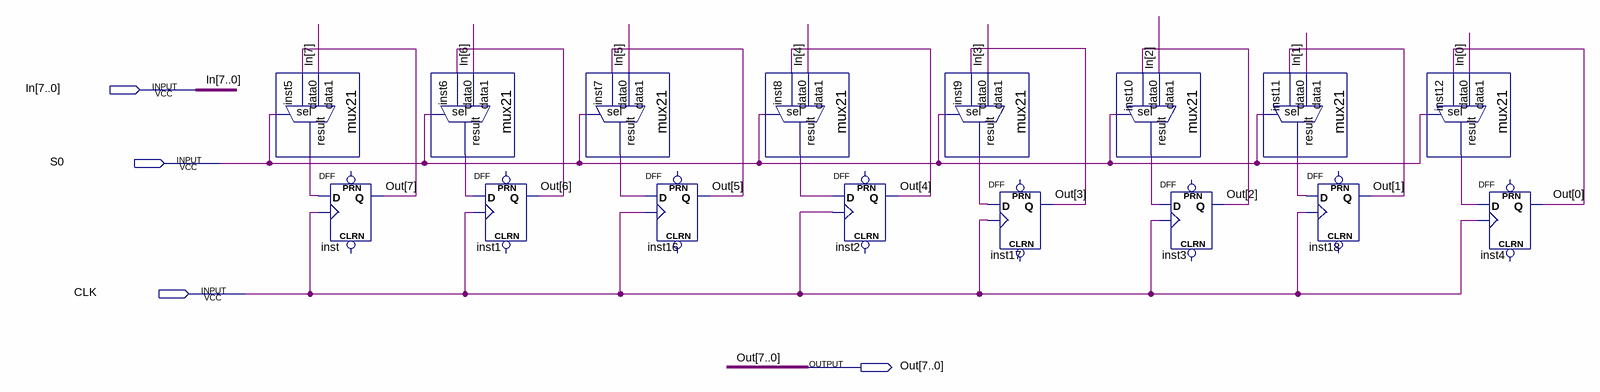
[diagram p0: schematic sheet]
// Quartus schematic Thanh_Ghi_8bit.bdf as structural Verilog: 16 symbols, 4 pins
module Thanh_Ghi_8bit (
  input  [7:0] In,
  input  S0,
  input  CLK,
  output [7:0] Out
);

  wire inst5_result, inst6_result, inst7_result, inst8_result, inst9_result, inst10_result, inst11_result,
       inst12_result;

  mux21 inst5 (.data1(In[7]), .data0(Out[7]), .sel(S0), .result(inst5_result));
  DFF inst (.CLK(CLK), .D(inst5_result), .Q(Out[7]));  // open: CLRN, PRN
  mux21 inst6 (.data1(In[6]), .data0(Out[6]), .sel(S0), .result(inst6_result));
  DFF inst1 (.CLK(CLK), .D(inst6_result), .Q(Out[6]));  // open: CLRN, PRN
  mux21 inst7 (.data1(In[5]), .data0(Out[5]), .sel(S0), .result(inst7_result));
  DFF inst16 (.CLK(CLK), .D(inst7_result), .Q(Out[5]));  // open: CLRN, PRN
  mux21 inst8 (.data1(In[4]), .data0(Out[4]), .sel(S0), .result(inst8_result));
  DFF inst2 (.CLK(CLK), .D(inst8_result), .Q(Out[4]));  // open: CLRN, PRN
  mux21 inst9 (.data1(In[3]), .data0(Out[3]), .sel(S0), .result(inst9_result));
  DFF inst17 (.CLK(CLK), .D(inst9_result), .Q(Out[3]));  // open: CLRN, PRN
  mux21 inst10 (.data1(In[2]), .data0(Out[2]), .sel(S0), .result(inst10_result));
  DFF inst3 (.CLK(CLK), .D(inst10_result), .Q(Out[2]));  // open: CLRN, PRN
  mux21 inst11 (.data1(In[1]), .data0(Out[1]), .sel(S0), .result(inst11_result));
  DFF inst18 (.CLK(CLK), .D(inst11_result), .Q(Out[1]));  // open: CLRN, PRN
  mux21 inst12 (.data1(In[0]), .data0(Out[0]), .sel(S0), .result(inst12_result));
  DFF inst4 (.CLK(CLK), .D(inst12_result), .Q(Out[0]));  // open: CLRN, PRN
endmodule
